# EAGLE schematic v1 (EAGLE 7.3.0)
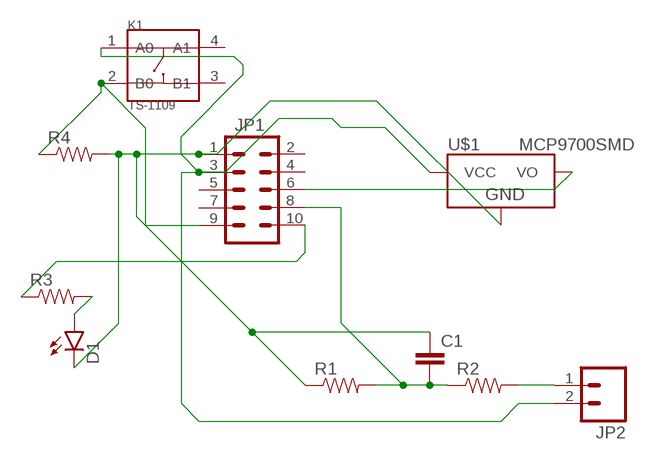
[diagram p0: schematic, sheet 1]

## Parts
C1  CAP0805  [0805]
D1  LED1206  [LED-1206]
JP1  M05X2PTH  [AVR_ICSP]
JP2  M02PTH  [1X02]
K1  TS-1109  DIP-BUTTON-4P  [SW4-6.0X6.0X5.0MM]
R1  RESISTOR0805-RES  [0805]
R2  RESISTOR0805-RES  [0805]
R3  RESISTOR0805-RES  [0805]
R4  RESISTOR0805-RES  [0805]
U$1  MCP9700SMD  [SOT23-3]

## Nets
GND: C1.1 D1.C JP1.1 R1.1 R4.2 U$1.3(GND)
N$1: JP1.9 K1.2(B0) R4.1
N$2: JP2.1 R2.2
N$4: D1.A R3.2
N$5: JP1.10 R3.1
N$8: JP1.6 U$1.2(VO)
N$9: C1.2 JP1.8 R1.2 R2.1
VDD: JP1.3 JP2.2 K1.1(A0) U$1.1(VCC)
Unconnected: JP1.2 JP1.4 JP1.5 JP1.7 K1.3(B1) K1.4(A1)

## Library data of the parts
C1 = SparkFun-Capacitors:CAP: Capacitor Standard 0603 ceramic capacitor, and 0.1" leaded capacitor.
D1 = SparkFun-LED:LED: LEDs Standard schematic elements and footprints for 5mm, 3mm, 1206, and 0603 sized LEDs. 5mm - Spark Fun Electronics SKU : COM-00529 (and others)
JP1 = SparkFun-Connectors:M05X2: Header 5x2 Standard 10-pin dual row 0.1" header. Commonly used with AVR-ISP. Use with Spark Fun Electronics SKU: PRT-00778
JP2 = SparkFun-Connectors:M02: Standard 2-pin 0.1" header. Use with - straight break away headers ( PRT-00116) - right angle break away headers (PRT-00553) - swiss pins (PRT-00743) - machine pins (PRT-00117) - female headers (PRT-00115) Molex polarized connector foot print use with: PRT-08233 with associated crimp pins and housings. 2.54_SCREWTERM for use with PRT-10571. 3.5mm Screw Terminal footprints for PRT-08084 5mm Screw Terminal footprints for use with PRT-08432
K1 = Seeed-OPL-Button:DIP-BUTTON-4P: 311020024
R1-R4 = SparkFun-Passives:RESISTOR: Resistor Basic schematic elements and footprints for 0603, 1206, and PTH resistors.
U$1 = SparkFun-Sensors:MCP9700: Analog-output temperature sensor; PROD_ID: IC-08917